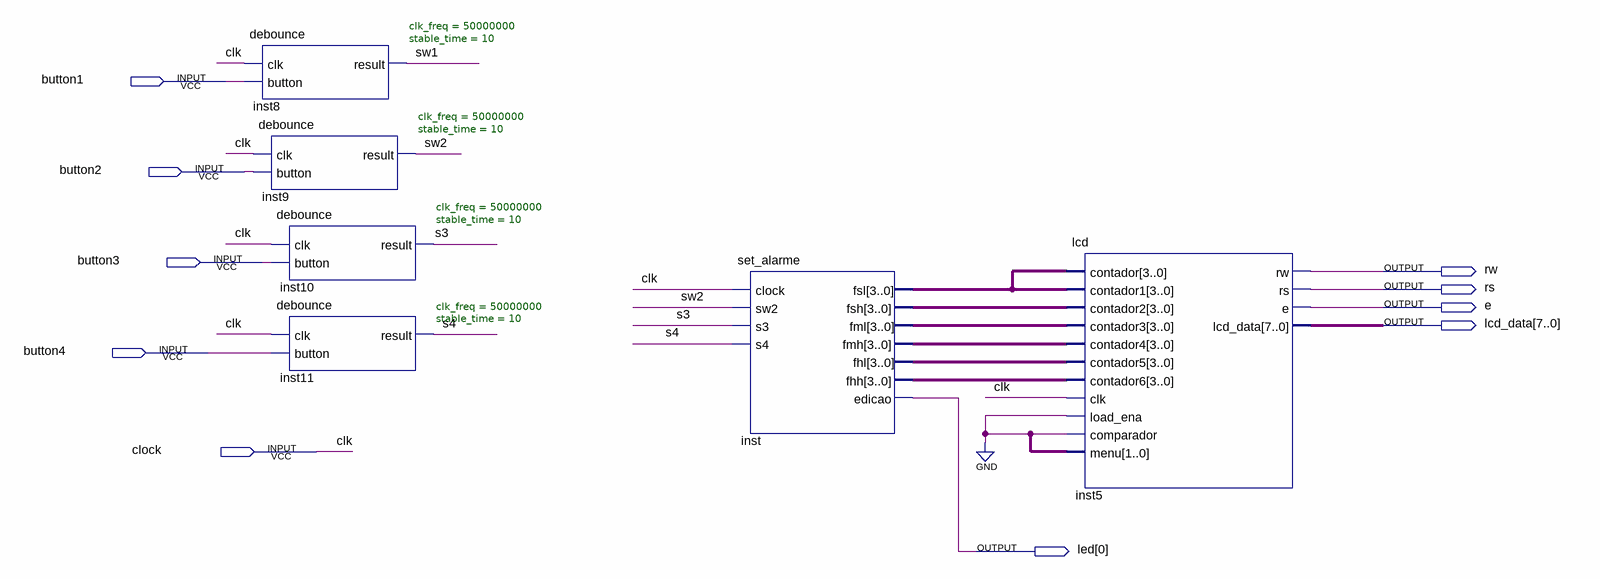
[diagram p0: schematic sheet]
// Quartus schematic teste_set_alarme.bdf as structural Verilog: 6 symbols, 10 pins
module teste_set_alarme (
  input  button1,
  input  button2,
  input  button3,
  input  button4,
  input  clock,
  output rw,
  output rs,
  output e,
  output [7:0] lcd_data,
  output [0:0] led
);

  wire s3, s4, sw1, sw2;
  wire [1:0] undriven;
  wire [3:0] inst_fhh, inst_fhl, inst_fmh, inst_fml, inst_fsh, inst_fsl;

  debounce #(.clk_freq(50000000), .stable_time(10)) inst8 (.clk(clock), .button(button1), .result(sw1));
  debounce #(.clk_freq(50000000), .stable_time(10)) inst9 (.clk(clock), .button(button2), .result(sw2));
  debounce #(.clk_freq(50000000), .stable_time(10)) inst10 (.clk(clock), .button(button3), .result(s3));
  debounce #(.clk_freq(50000000), .stable_time(10)) inst11 (.clk(clock), .button(button4), .result(s4));
  set_alarme inst (
    .clock(clock), .sw2(sw2), .s3(s3), .s4(s4), .fsl(inst_fsl), .fsh(inst_fsh), .fml(inst_fml),
    .fmh(inst_fmh), .fhl(inst_fhl), .fhh(inst_fhh), .edicao(led[0]));
  lcd inst5 (
    .contador(inst_fsl), .contador1(inst_fsl), .contador2(inst_fsh), .contador3(inst_fml),
    .contador4(inst_fmh), .contador5(inst_fhl), .contador6(inst_fhh), .clk(clock), .load_ena(1'b0),
    .comparador(1'b0), .menu(undriven), .rw(rw), .rs(rs), .e(e), .lcd_data(lcd_data));

  // Other names for the same wires on the sheet: clk = clock
endmodule
